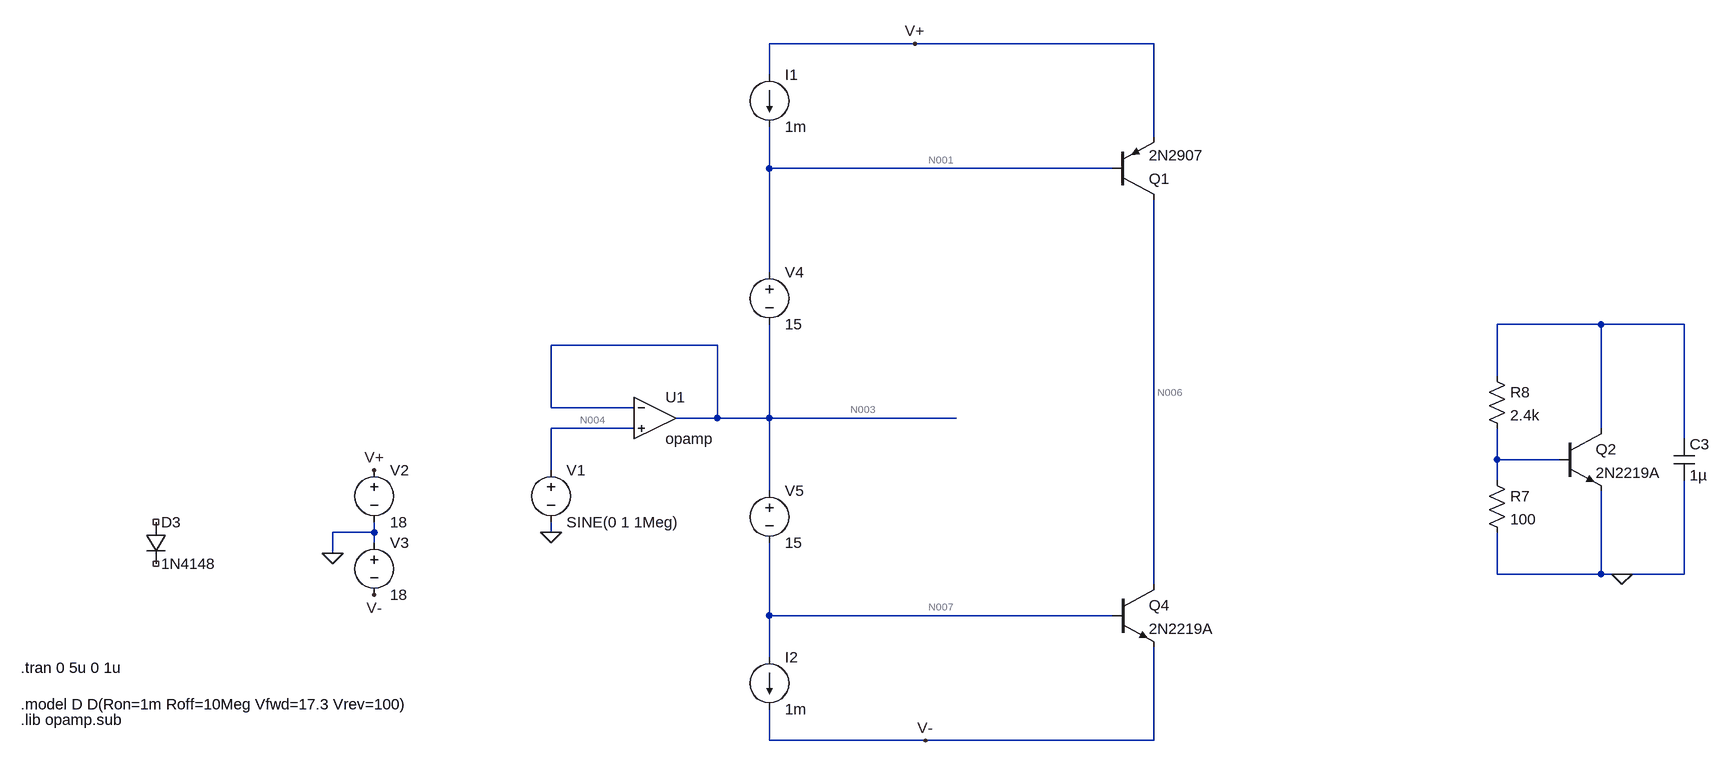
[diagram p0: schematic buffer.asc]
buffer.asc, the LTspice schematic file:
Version 4
SHEET 1 1576 700
WIRE 352 -416 128 -416
WIRE 720 -416 352 -416
WIRE 128 -368 128 -416
WIRE 720 -272 720 -416
WIRE 128 -224 128 -288
WIRE 656 -224 128 -224
WIRE 128 -64 128 -224
WIRE 1408 16 1248 16
WIRE 1536 16 1408 16
WIRE 48 48 -208 48
WIRE 1248 96 1248 16
WIRE -208 144 -208 48
WIRE -80 144 -208 144
WIRE 48 160 48 48
WIRE 48 160 -16 160
WIRE 128 160 128 16
WIRE 128 160 48 160
WIRE 416 160 128 160
WIRE -80 176 -208 176
WIRE 1408 176 1408 16
WIRE 1536 192 1536 16
WIRE 1248 224 1248 176
WIRE 1344 224 1248 224
WIRE -208 240 -208 176
WIRE 1248 256 1248 224
WIRE 128 272 128 160
WIRE -480 336 -480 320
WIRE -480 336 -544 336
WIRE -208 336 -208 320
WIRE -480 352 -480 336
WIRE -544 368 -544 336
WIRE 1248 400 1248 336
WIRE 1408 400 1408 272
WIRE 1408 400 1248 400
WIRE 1440 400 1408 400
WIRE 1536 400 1536 256
WIRE 1536 400 1440 400
WIRE 720 416 720 -176
WIRE 128 464 128 352
WIRE 656 464 128 464
WIRE 128 528 128 464
WIRE 128 656 128 608
WIRE 368 656 128 656
WIRE 720 656 720 512
WIRE 720 656 368 656
FLAG 352 -416 V+
FLAG 368 656 V-
FLAG -208 336 0
FLAG -544 368 0
FLAG -480 432 V-
FLAG -480 240 V+
FLAG 1440 400 0
SYMBOL OpAmps\\opamp -48 96 R0
SYMATTR InstName U1
SYMBOL voltage -208 224 R0
WINDOW 123 0 0 Left 0
WINDOW 39 0 0 Left 0
SYMATTR InstName V1
SYMATTR Value SINE(0 1 1Meg)
SYMBOL voltage -480 224 R0
WINDOW 123 0 0 Left 0
WINDOW 39 0 0 Left 0
SYMATTR InstName V2
SYMATTR Value 18
SYMBOL voltage -480 336 R0
WINDOW 123 0 0 Left 0
WINDOW 39 0 0 Left 0
SYMATTR InstName V3
SYMATTR Value 18
SYMBOL diode -832 320 R0
SYMATTR InstName D3
SYMATTR Value 1N4148
SYMBOL current 128 -368 R0
WINDOW 123 0 0 Left 0
WINDOW 39 0 0 Left 0
SYMATTR InstName I1
SYMATTR Value 1m
SYMBOL current 128 528 R0
WINDOW 123 0 0 Left 0
WINDOW 39 0 0 Left 0
SYMATTR InstName I2
SYMATTR Value 1m
SYMBOL npn 656 416 R0
SYMATTR InstName Q4
SYMATTR Value 2N2219A
SYMBOL pnp 656 -176 M180
SYMATTR InstName Q1
SYMATTR Value 2N2907
SYMBOL res 1232 240 R0
SYMATTR InstName R7
SYMATTR Value 100
SYMBOL res 1232 80 R0
SYMATTR InstName R8
SYMATTR Value 2.4k
SYMBOL cap 1520 192 R0
SYMATTR InstName C3
SYMATTR Value 1µ
SYMBOL npn 1344 176 R0
SYMATTR InstName Q2
SYMATTR Value 2N2219A
SYMBOL voltage 128 -80 R0
WINDOW 123 0 0 Left 0
WINDOW 39 0 0 Left 0
SYMATTR InstName V4
SYMATTR Value 15
SYMBOL voltage 128 256 R0
WINDOW 123 0 0 Left 0
WINDOW 39 0 0 Left 0
SYMATTR InstName V5
SYMATTR Value 15
TEXT -1024 544 Left 2 !.tran 0 5u 0 1u
TEXT -1024 600 Left 2 !.model D D(Ron=1m Roff=10Meg Vfwd=17.3 Vrev=100)
TEXT -1024 624 Left 2 !.lib opamp.sub

The netlist it stands for:
* buffer.asc
XU1 N003 N004 N003 opamp Aol=100K GBW=10Meg  ; pins invin noninvin out
V1 N004 0 SINE(0 1 1Meg)
V2 V+ 0 18
V3 0 V- 18
D3 NC_01 NC_02 1N4148
I1 V+ N001 1m
I2 N007 V- 1m
Q4 N006 N007 V- 0 2N2219A
Q1 N006 N001 V+ 0 2N2907
R7 N005 0 100
R8 N002 N005 2.4k
C3 N002 0 1µ
Q2 N002 N005 0 0 2N2219A
V4 N001 N003 15
V5 N003 N007 15
.model D D
.lib standard.dio
.model NPN NPN
.model PNP PNP
.lib standard.bjt
.tran 0 5u 0 1u
.model D D(Ron=1m Roff=10Meg Vfwd=17.3 Vrev=100)
.lib opamp.sub
.backanno
.end

* Results of the author's LTspice run, read from the files saved beside the schematic
* Operating Point, zero values left out:
*   V(n003) = -761.2 nV
*   V(v+) = 18 V
*   V(v-) = -18 V
*   V(n001) = 15 V
*   V(n007) = -15 V
*   V(n006) = -12.54 V
*   Ic(Q4) = 3.683 A
*   Ib(Q4) = 207.4 mA
*   Ie(Q4) = -3.891 A
*   Ic(Q1) = -3.683 A
*   Ib(Q1) = -131.3 mA
*   Ie(Q1) = 3.815 A
*   I(I1) = 1 mA
*   I(I2) = 1 mA
*   I(V2) = -3.816 A
*   I(V3) = -3.892 A
*   I(V4) = 132.3 mA
*   I(V5) = 208.4 mA
*   Ix(u1:3) = -76.12 mA
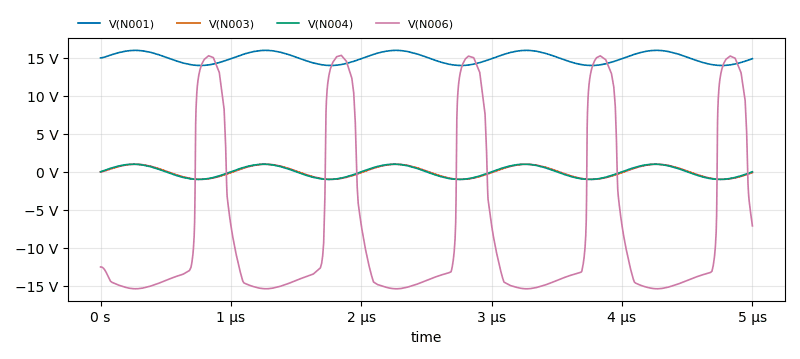
[diagram p1: Transient Analysis of buffer.asc, plotted from the saved traces]
* Transient Analysis, 1 run:
*   V(N001): min 14 V, max 15.99 V, average 15 V, rms 15.02 V, last 14.9 V
*   V(N003): min -995 mV, max 994.9 mV, average -451.3 µV, rms 704.4 mV, last -99.04 mV
*   V(N004): min -999.9 mV, max 999.8 mV, average -788.4 µV, rms 708.2 mV, last 0 V
*   V(N006): min -15.41 V, max 15.33 V, average -7.318 V, rms 13.66 V, last -7.127 V